# EAGLE design STRIP pins (EAGLE 9.6.2)
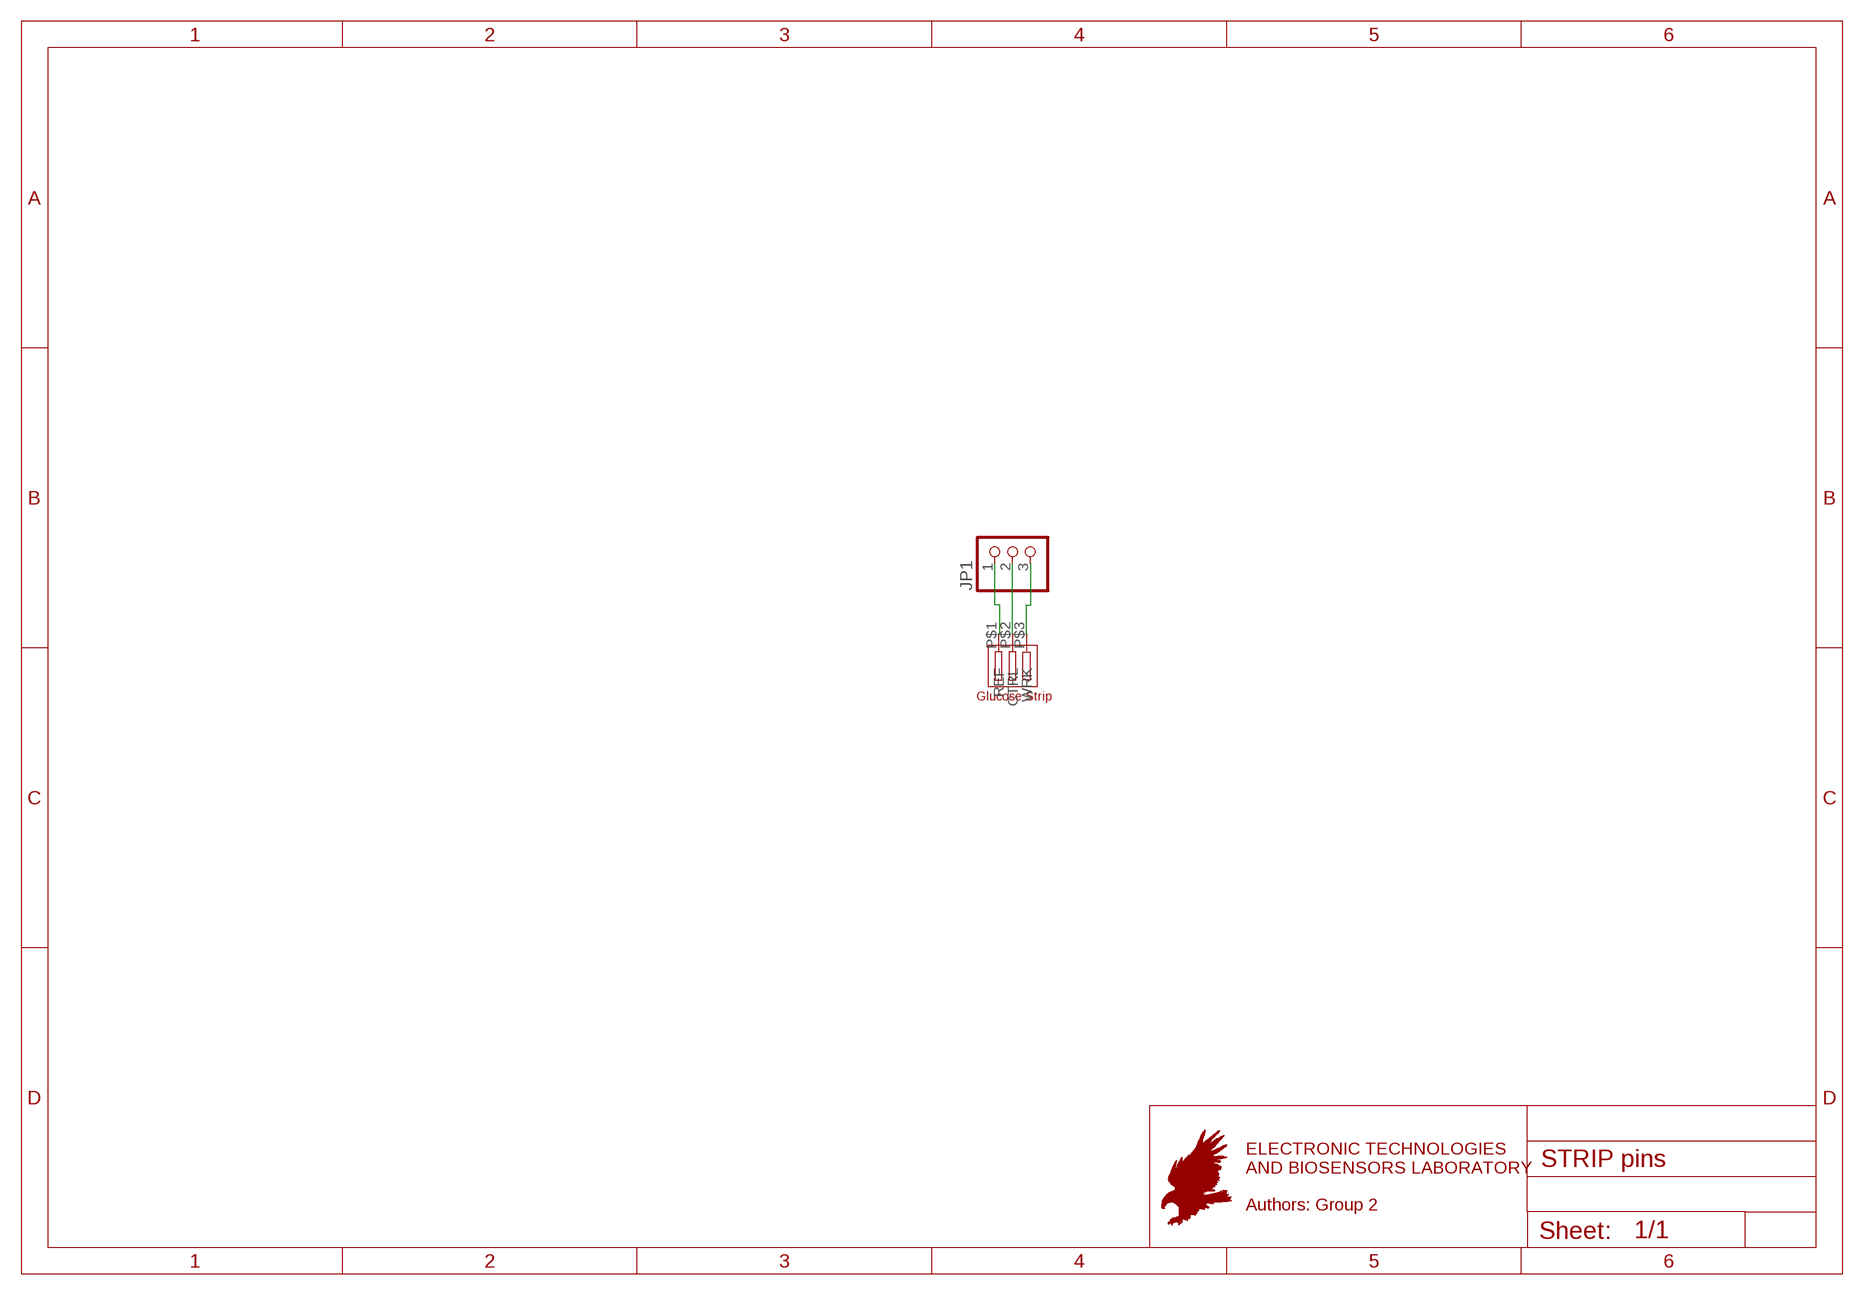
[diagram p0: schematic, sheet 1]

## Parts
JP1  PINHD-1X3  [1X03]
U$1  GLUCOSE_STRIP  [GLUCOSE_STRIP]

## Nets
N$1: JP1.1 U$1.P$1(REF)
N$2: JP1.2 U$1.P$2(CTRL)
N$3: JP1.3 U$1.P$3(WRK)

## Notes on the sheet
- ELECTRONIC TECHNOLOGIES
  AND BIOSENSORS LABORATORY
  
  Authors: Group 2

## Library data of the parts
JP1 = pinhead:PINHD-1X3: PIN HEADER
U$1 = ETBL:GLUCOSE_STRIP

## Board
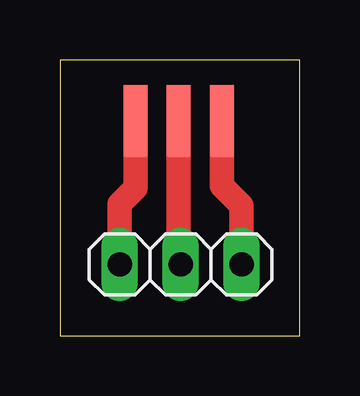
[diagram p1: board, top side]

Size 10 x 11.5 mm. Coordinates in mm from the lower left corner, seen from the top.
Outline: 0,0 10,0 10,11.5 0,11.5 0,0
Copper layers (1*16): Top 0.035mm / dielectric 1.5mm / Bottom 0.035mm
Design rules "default": minimum track width 6mil, minimum drill 0.35mm, track to track 6mil, track to pad 6mil, pad to pad 6mil, via to via 6mil, smd to smd 6mil, copper to edge 40mil, drill to drill 6mil, minimum pad ring 10mil, minimum via ring 8mil, stop-mask expansion 4mil, vias tented up to drill 0mil, thermal gap 10mil

### Footprints (pad centres in the part's own frame; a part is rotated, then mirrored left to right if it is on the bottom)
1X03 = drill 1.016 long: 1 -2.54,0; 2 0,0; 3 2.54,0
GLUCOSE_STRIP = smd 1 x 3: P$1 -1.8,0; P$2 0,0; P$3 1.8,0

### Placement (x,y rotation side)
JP1  5.04,2.97 0 top
U$1  4.95,8.95 0 top

### Tracks (layer width: path | path; a pad name or v marks a point on that pad's centre or on a via)
N$1
  Top 1.016: JP1.1 2.5,5.5 3.15,6.15 U$1.P$1
N$2
  Top 1.016: JP1.2 4.95,3.06 U$1.P$2
N$3
  Top 1.016: JP1.3 7.58,5.42 6.75,6.25 U$1.P$3